# Altium project Valves.PrjPcb
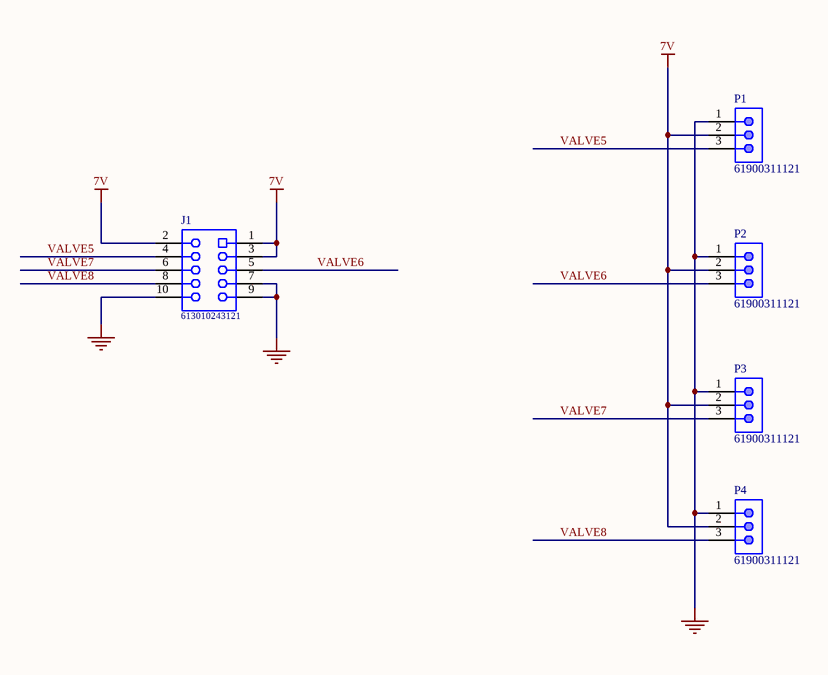
[diagram p0: Valves.SchDoc]
1 sheet, 5 parts. Net scope: global (net labels, ports and power ports of the same name join across sheets).
Board file: Valve.PcbDoc

## Sheet Valves.SchDoc
size A3; SheetNumber: 1; SheetTotal: 1

### Parts
J1  613010243121  [613010243121]
P1  61900311121  [61900311121]
P2  61900311121  [61900311121]
P3  61900311121  [61900311121]
P4  61900311121  [61900311121]

### Nets
7V: J1.1 J1.2 J1.3 P1.2 P2.2 P3.2 P4.2
GND: J1.7 J1.9 J1.10 P1.1 P2.1 P3.1 P4.1
VALVE5: J1.4 P1.3
VALVE6: J1.5 P2.3
VALVE7: J1.6 P3.3
VALVE8: J1.8 P4.3

### Library data of the parts
J1 = 613010243121: WR-PHD Socket Header, THT, pitch 2.54mm, Dual Row, Angled, 10p; Manufacturer: Wurth Elektronik; Pin Number: 10; Rated Current: 3A; Working Voltage: 250VAC; Withstanding Voltage: 500VAC; Contact Resistance: 20mOhm; ComponentLink1Description: Manufacturer; ComponentLink1URL: http://www.we-online.de; ComponentLink2Description: Datasheet; ComponentLink2URL: https://www.we-online.com/catalog/datasheet/613010243121.pdf; Manufacturer Part Number: 613010243121; Pitch: 2.54mm; Operating Temperature: -40 to +125degC; Mounting Technology: THT; Packaging: Tray; Gender: Socket Header; Row Number: Dual; Orientation: Angled
P1-P4 = 61900311121: WR-WTB THT Male Vertical Locking Header, pitch 2.54mm, 3p; Pin Number: 3; Contact Resistance: 20mOhm; Rated Current: 3A; Withstanding Voltage: 1000VAC; Working Voltage: 250VAC; ComponentLink1Description: Manufacturer; ComponentLink1URL: http://www.we-online.de; ComponentLink2Description: Datasheet; ComponentLink2URL: https://www.we-online.com/catalog/datasheet/61900311121.pdf; Pitch: 2.54mm; Published Date: January 2020; Publisher: Wurth Elektronik; Mounting Technology: THT; Packaging: Bag; Operating Temperature: -40 to +105degC; Part Number: 61900311121; Gender: Male; Type: Vertical